# Altium schematic sheet dcdc.SchDoc
size A3; SheetNumber: 2; SheetTotal: 2
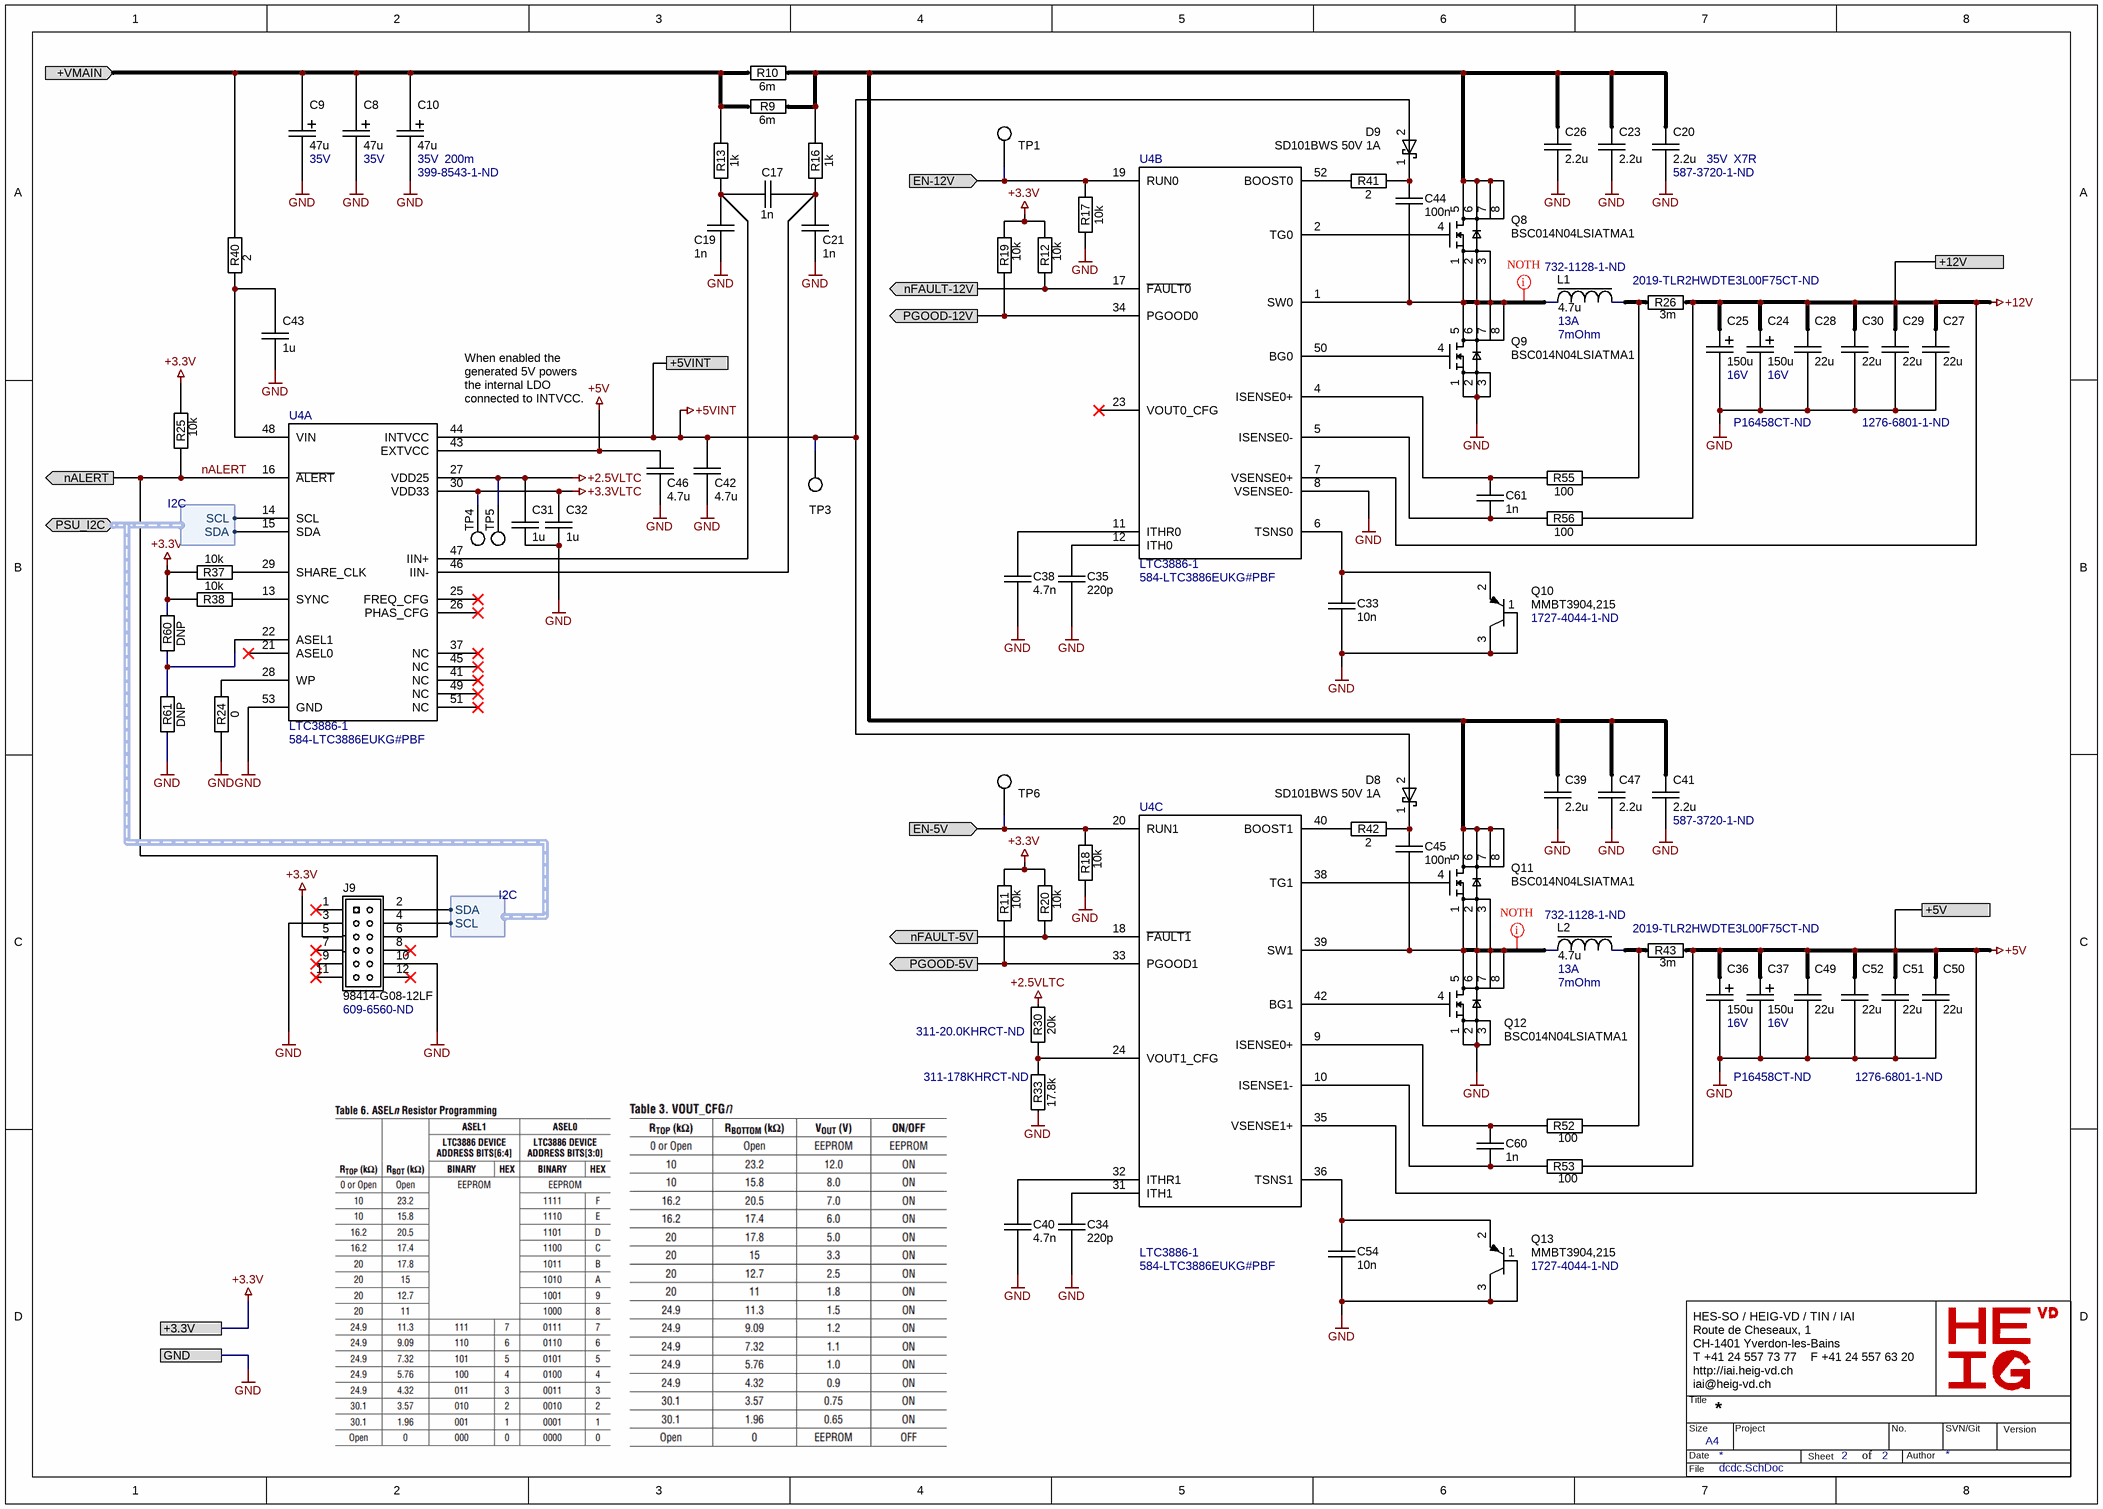
[diagram p0: dcdc.SchDoc]

## Parts
C8  47u  Voltage: 35V  [CAP-TANTAL-2917-7343]
C9  47u  Voltage: 35V  [CAP-TANTAL-2917-7343]
C10  47u  Supplier Part Number 1: 399-8543-1-ND  Voltage: 35V  ESR: 200m  [CAP-TANTAL-2917-7343]
C17  1n  [SM/C0603]
C19  1n  [SM/C0603]
C20  2.2u  Voltage: 35V  Dielectric: X7R  Supplier Part Number 1: 587-3720-1-ND  [SM/C1210]
C21  1n  [SM/C0603]
C23  2.2u  [SM/C1210]
C24  150u  Voltage: 16V  Supplier Part Number 1: P16458CT-ND  [CAP_16SVP150M]
C25  150u  Voltage: 16V  [CAP_16SVP150M]
C26  2.2u  [SM/C1210]
C27  22u  Supplier Part Number 1: 1276-6801-1-ND  [SM/C1210]
C28  22u  [SM/C1210]
C29  22u  [SM/C1210]
C30  22u  [SM/C1210]
C31  1u  [SM/C0603]
C32  1u  [SM/C0603]
C33  10n  [SM/C0603]
C34  220p  [SM/C0603]
C35  220p  [SM/C0603]
C36  150u  Voltage: 16V  [CAP_16SVP150M]
C37  150u  Voltage: 16V  Supplier Part Number 1: P16458CT-ND  [CAP_16SVP150M]
C38  4.7n  [SM/C0603]
C39  2.2u  [SM/C1210]
C40  4.7n  [SM/C0603]
C41  2.2u  Supplier Part Number 1: 587-3720-1-ND  [SM/C1210]
C42  4.7u  [SM/C0603]
C43  1u  [SM/C0603]
C44  100n  [SM/C0603]
C45  100n  [SM/C0603]
C46  4.7u  [SM/C0603]
C47  2.2u  [SM/C1210]
C49  22u  [SM/C1210]
C50  22u  Supplier Part Number 1: 1276-6801-1-ND  [SM/C1210]
C51  22u  [SM/C1210]
C52  22u  [SM/C1210]
C54  10n  [SM/C0603]
C60  1n  [SM/C0603]
C61  1n  [SM/C0603]
D8  SD101BWS 50V 1A  [SOD323]
D9  SD101BWS 50V 1A  [SOD323]
J9  98414-G08-12LF  Supplier Part Number 1: 609-6560-ND  [CONN14 2mm]
L1  4.7u  Supplier Part Number 1: 732-1128-1-ND  Imax: 13A  Rs: 7mOhm  [WE-7443551470]
L2  4.7u  Supplier Part Number 1: 732-1128-1-ND  Imax: 13A  Rs: 7mOhm  [WE-7443551470]
Q8  BSC014N04LSIATMA1  [PG-TDSON-8_INF]
Q9  BSC014N04LSIATMA1  [PG-TDSON-8_INF]
Q10  MMBT3904,215  Supplier Part Number 1: 1727-4044-1-ND  [SOT23-3]
Q11  BSC014N04LSIATMA1  [PG-TDSON-8_INF]
Q12  BSC014N04LSIATMA1  [PG-TDSON-8_INF]
Q13  MMBT3904,215  Supplier Part Number 1: 1727-4044-1-ND  [SOT23-3]
R9  6m  [SM/R1206]
R10  6m  [SM/R1206]
R11  10k  [SM/R0603]
R12  10k  [SM/R0603]
R13  1k  [SM/R0603]
R16  1k  [SM/R0603]
R17  10k  [SM/R0603]
R18  10k  [SM/R0603]
R19  10k  [SM/R0603]
R20  10k  [SM/R0603]
R24  0  [SM/R0603]
R25  10k  [SM/R0603]
R26  3m  [SM/R2010]
R30  20k  Supplier Part Number 1: 311-20.0KHRCT-ND  [SM/R0603]
R33  17.8k  Supplier Part Number 1: 311-178KHRCT-ND  [SM/R0603]
R37  10k  [SM/R0603]
R38  10k  [SM/R0603]
R40  2  [SM/R0603]
R41  2  [SM/R0603]
R42  2  [SM/R0603]
R43  3m  [SM/R2010]
R52  100  [SM/R0603]
R53  100  [SM/R0603]
R55  100  [SM/R0603]
R56  100  [SM/R0603]
R60  DNP  [SM/R0603]
R61  DNP  [SM/R0603]
TP1  TP  [TP/0.6]  (value not drawn)  (no BOM)
TP3  TP  [TP/0.6]  (value not drawn)  (no BOM)
TP4  TP  [TP/0.6]  (value not drawn)  (no BOM)
TP5  TP  [TP/0.6]  (value not drawn)  (no BOM)
TP6  TP  [TP/0.6]  (value not drawn)  (no BOM)
U4  LTC3886-1  Supplier Part Number 1: 584-LTC3886EUKG#PBF  [LT3886]  (parts A,B,C of 3)

## Ports
+3.3V, +5V, +5VINT, +12V, +VMAIN (in), EN-5V (in), EN-12V (in), GND, nALERT (out), nFAULT-5V (out), nFAULT-12V (out), PGOOD-5V (out), PGOOD-12V (out), PSU_I2C (bidir, harness I2C)

## Harnesses
I2C: SDA, SCL

## Nets
+2.5VLTC: C31.1 R30.2 TP5.1 U4.27(VDD25)
+3.3V: J9.5 R11.2 R12.2 R19.2 R20.2 R25.2 R37.2 R38.2 R60.1 ; port +3.3V
+3.3VLTC: C32.1 TP4.1 U4.30(VDD33)
+5V: C36.1(+) C37.1(+) C46.1 C49.1 C50.1 C51.1 C52.1 R43.1 R53.2 U4.35(VSENSE1+) U4.43(EXTVCC) ; port +5V
+5VINT: C42.1 D8.2(ANODE) D9.2(ANODE) TP3.1 U4.44(INTVCC) ; port +5VINT
+12V: C24.1(+) C25.1(+) C27.1 C28.1 C29.1 C30.1 R26.1 R56.2 U4.7(VSENSE0+) ; port +12V
GND: C8.2(-) C9.2(-) C10.2(-) C19.2 C20.1 C21.2 C23.1 C24.2(-) C25.2(-) C26.1 C27.2 C28.2 C29.2 C30.2 C31.2 C32.2 C33.2 C34.2 C35.2 C36.2(-) C37.2(-) C38.2 C39.1 C40.2 C41.1 C42.2 C43.2 C46.2 C47.1 C49.2 C50.2 C51.2 C52.2 C54.2 J9.3 J9.10 Q9.1(S) Q9.2(S) Q9.3(S) Q10.1(B) Q10.3(C) Q12.1(S) Q12.2(S) Q12.3(S) Q13.1(B) Q13.3(C) R17.1 R18.1 R24.2 R33.1 R61.2 U4.8(VSENSE0-) U4.53(GND) ; port GND
+VMAIN: C8.1(+) C9.1(+) C10.1(+) R9.1 R10.1 R13.2 R40.2 ; port +VMAIN
EN-5V: R18.2 TP6.1 U4.20(RUN1) ; port EN-5V
EN-12V: R17.2 TP1.1 U4.19(RUN0) ; port EN-12V
nALERT: J9.6 R25.1 U4.16(~{ALERT}) ; port nALERT
nFAULT-5V: R20.1 U4.18(~{FAULT1}) ; port nFAULT-5V
nFAULT-12V: R12.1 U4.17(~{FAULT0}) ; port nFAULT-12V
PGOOD-5V: R11.1 U4.33(PGOOD1) ; port PGOOD-5V
PGOOD-12V: R19.1 U4.34(PGOOD0) ; port PGOOD-12V
NetC17_1: C17.1 C19.1 R13.1 U4.47(IIN+)
NetC17_2: C17.2 C21.1 R16.1 U4.46(IIN-)
NetC20_2: C20.2 C23.2 C26.2 C39.2 C41.2 C47.2 Q8.5(D) Q8.6(D) Q8.7(D) Q8.8(D) Q11.5(D) Q11.6(D) Q11.7(D) Q11.8(D) R9.2 R10.2 R16.2
NetC33_1: C33.1 Q10.2(E) U4.6(TSNS0)
NetC34_1: C34.1 U4.31(ITH1)
NetC35_1: C35.1 U4.12(ITH0)
NetC38_1: C38.1 U4.11(ITHR0)
NetC40_1: C40.1 U4.32(ITHR1)
NetC43_1: C43.1 R40.1 U4.48(VIN)
NetC44_1: C44.1 D9.1(CATHODE) R41.2
NetC44_2: C44.2 L1.2 Q8.1(S) Q8.2(S) Q8.3(S) Q9.5(D) Q9.6(D) Q9.7(D) Q9.8(D) U4.1(SW0)
NetC45_1: C45.1 D8.1(CATHODE) R42.2
NetC45_2: C45.2 L2.2 Q11.1(S) Q11.2(S) Q11.3(S) Q12.5(D) Q12.6(D) Q12.7(D) Q12.8(D) U4.39(SW1)
NetC54_1: C54.1 Q13.2(E) U4.36(TSNS1)
NetC60_1: C60.1 R52.1 U4.9(ISENSE0+)
NetC60_2: C60.2 R53.1 U4.10(ISENSE1-)
NetC61_1: C61.1 R55.1 U4.4(ISENSE0+)
NetC61_2: C61.2 R56.1 U4.5(ISENSE0-)
NetJ9_2: J9.2 U4.15(SDA) ; port PSU_I2C.SDA
NetJ9_4: J9.4 U4.14(SCL) ; port PSU_I2C.SCL
NetL1_1: L1.1 R26.2 R55.2
NetL2_1: L2.1 R43.2 R52.2
NetQ8_4: Q8.4(Gate) U4.2(TG0)
NetQ9_4: Q9.4(Gate) U4.50(BG0)
NetQ11_4: Q11.4(Gate) U4.38(TG1)
NetQ12_4: Q12.4(Gate) U4.42(BG1)
NetR24_1: R24.1 U4.28(WP)
NetR30_1: R30.1 R33.2 U4.24(VOUT1_CFG)
NetR37_1: R37.1 U4.29(SHARE_CLK)
NetR38_1: R38.1 U4.13(SYNC)
NetR41_1: R41.1 U4.52(BOOST0)
NetR42_1: R42.1 U4.40(BOOST1)
NetR60_2: R60.2 R61.1 U4.22(ASEL1)

Not connected (* = marked no-connect by the designer): J9 1* 7* 8* 9* 11* 12*; U4 21(ASEL0)* 23(VOUT0_CFG)* 25(FREQ_CFG)* 26(PHAS_CFG)* 37(NC)* 41(NC)* 45(NC)* 49(NC)* 51(NC)*

## Layout directives
rule Polygon Connect Style [Style - Direct Connect]: NetC44_2, NetC45_2

## Notes on the sheet
- (near U4) When enabled the generated 5V powers the internal LDO connected to INTVCC.
- HES-SO / HEIG-VD / TIN / IAI
  Route de Cheseaux, 1
  CH-1401 Yverdon-les-Bains
  T +41 24 557 73 77    F +41 24 557 63 20
  http://iai.heig-vd.ch
  iai@heig-vd.ch
- Title
- Size
- Date
- A4
- Project
- Sheet
- of
- No.
- Author
- SVN/Git
- Version
- File

## Library data of the parts
C8 C9 = C+2312: 47µF Molded Tantalum Capacitors 25V 2917 (7343 Metric) 900mOhm; Rule: UNIONINDEX=0|RULEKIND=PolygonConnect|NETSCOPE=AnyNet|LAYERKIND=SameLayer|NAME=Schematic Polygon Connect Style|CONNECTSTYLE=Relief|RELIEFCONDUCTORWIDTH=39.3701mil|RELIEFENTRIES=4|POLYGONRELIEFANGLE=90 Angle|AIRGAPWIDTH=5.9055mil|UNIT=Metric; ESR: 200m; Supplier 1: Digi-Key; Supplier Part Number 1: 399-8543-1-ND; Value: 47u
C10 = C+2312: 47µF Molded Tantalum Capacitors 25V 2917 (7343 Metric) 900mOhm; Rule: UNIONINDEX=0|RULEKIND=PolygonConnect|NETSCOPE=AnyNet|LAYERKIND=SameLayer|NAME=Schematic Polygon Connect Style|CONNECTSTYLE=Relief|RELIEFCONDUCTORWIDTH=39.3701mil|RELIEFENTRIES=4|POLYGONRELIEFANGLE=90 Angle|AIRGAPWIDTH=5.9055mil|UNIT=Metric; Supplier 1: Digi-Key; Value: 47u
C17 C19 C21 C31-C35 C38 C40 C42-C46 C54 C60 C61 = C: Chip Capacitor; Voltage: 16V; Dielectric: X7R
  C17 C60: Supplier 2 Part Number: 1292-1393-1-ND; Supplier 2: Digi-Key; Value: 1n
  C19 C21 C61: Value: 1n
  C31 C32: Value: 1u
  C33: Supplier 2 Part Number: 1292-1393-1-ND; Supplier 2: Digi-Key; Value: 10n
  C34 C35: Supplier 2 Part Number: 1292-1393-1-ND; Supplier 2: Digi-Key; Value: 220p
  C38 C40: Supplier 2 Part Number: 1292-1393-1-ND; Supplier 2: Digi-Key; Value: 4.7n
  C42 C46: Value: 4.7u
  C43: Supplier 2 Part Number: 1292-1393-1-ND; Supplier 2: Digi-Key; Value: 1u
  C44 C45: Supplier 2 Part Number: 1292-1393-1-ND; Supplier 2: Digi-Key; Value: 100n
  C54: Value: 10n
C20 C23 C26 = C: GMK325B7225KNHT CAP CER 2.2UF 35V X7R 1210; Rule: UNIONINDEX=0|RULEKIND=PolygonConnect|NETSCOPE=AnyNet|LAYERKIND=SameLayer|NAME=Schematic Polygon Connect Style|CONNECTSTYLE=Relief|RELIEFCONDUCTORWIDTH=39.3701mil|RELIEFENTRIES=4|POLYGONRELIEFANGLE=90 Angle|AIRGAPWIDTH=5.9055mil|UNIT=Metric; Supplier 1: Digi-Key; Value: GMK325B7225KNHT
  C23 C26: Voltage: 35V; Dielectric: X7R; Supplier Part Number 1: 587-3720-1-ND
C24 C25 C36 C37 = C+2312: CAP ALUM POLY 150UF 20% 16V SMD; Rule: UNIONINDEX=0|RULEKIND=PolygonConnect|NETSCOPE=AnyNet|LAYERKIND=SameLayer|NAME=Schematic Polygon Connect Style|CONNECTSTYLE=Relief|RELIEFCONDUCTORWIDTH=39.3701mil|RELIEFENTRIES=4|POLYGONRELIEFANGLE=90 Angle|AIRGAPWIDTH=5.9055mil|UNIT=Metric; Value: 16SVP150M; Supplier 1: Digi-Key
  C25 C36: Supplier Part Number 1: P16458CT-ND
C27-C29 C49-C52 = C: CL32B226KOJVPJE CAP CER 22UF 16V X7R 1210; Rule: UNIONINDEX=0|RULEKIND=PolygonConnect|NETSCOPE=AnyNet|LAYERKIND=SameLayer|NAME=Schematic Polygon Connect Style|CONNECTSTYLE=Relief|RELIEFCONDUCTORWIDTH=39.3701mil|RELIEFENTRIES=4|POLYGONRELIEFANGLE=90 Angle|AIRGAPWIDTH=5.9055mil|UNIT=Metric; Supplier 1: Digi-Key; Value: 22u
  C28 C29 C49 C51 C52: Supplier Part Number 1: 1276-6801-1-ND
C30 = C: CL32B226KOJVPJE CAP CER 22UF 16V X7R 1210; Rule: UNIONINDEX=0|RULEKIND=PolygonConnect|NETSCOPE=AnyNet|LAYERKIND=SameLayer|NAME=Schematic Polygon Connect Style|THPAD.CONNECTSTYLE=Relief|THPAD.RELIEFCONDUCTORWIDTH=39.3701mil|THPAD.RELIEFENTRIES=4|THPAD.POLYGONRELIEFANGLE=90 Angle|THPAD.AIRGAPWIDTH=5.9055mil|SMDPAD.CONNECTSTYLE=Relief|SMDPAD.RELIEFCONDUCTORWIDTH=39.3701mil|SMDPAD.RELIEFENTRIES=4|SMDPAD.POLYGONRELIEFANGLE=90 Angle|SMDPAD.AIRGAPWIDTH=5.9055mil|VIA.CONNECTSTYLE=Direct|VIA.RELIEFCONDUCTORWIDTH=10mil|VIA.RELIEFENTRIES=4|VIA.POLYGONRELIEFANGLE=45 Angle|VIA.AIRGAPWIDTH=10mil|UNIT=Metric; Supplier 1: Digi-Key; Supplier Part Number 1: 1276-6801-1-ND; Value: 22u
C39 C41 C47 = C: GMK325B7225KNHT CAP CER 2.2UF 35V X7R 1210; Voltage: 16V; Rule: UNIONINDEX=0|RULEKIND=PolygonConnect|NETSCOPE=AnyNet|LAYERKIND=SameLayer|NAME=Schematic Polygon Connect Style|CONNECTSTYLE=Relief|RELIEFCONDUCTORWIDTH=39.3701mil|RELIEFENTRIES=4|POLYGONRELIEFANGLE=90 Angle|AIRGAPWIDTH=5.9055mil|UNIT=Metric; Dielectric: X7R; Supplier 2 Part Number: 1292-1393-1-ND; Supplier 2: Digi-Key; Supplier 1: Digi-Key; Value: 2.2u
  C39 C47: Supplier Part Number 1: 587-3720-1-ND
D8 D9 = D SCHOTTKY CUS520: Diode Schottky 30V 200mA Surface Mount USC; Value: SD101BWS-TP; Supplier 1: Digi-Key; Supplier Part Number 1: SD101BWSTPMSCT-ND
J9 = CONN 12: CONN HEADER VERT 12POS 2MM; Supplier 1: Digi-Key; Value: 98414-G08-12LF
L1 L2 = L: FIXED IND 4.7UH 13A 7 MOHM SMD / 7443551470; Value: 732-1128-1-ND; Rule: UNIONINDEX=0|RULEKIND=PolygonConnect|NETSCOPE=AnyNet|LAYERKIND=SameLayer|NAME=Schematic Polygon Connect Style|THPAD.CONNECTSTYLE=Relief|THPAD.RELIEFCONDUCTORWIDTH=39.3701mil|THPAD.RELIEFENTRIES=4|THPAD.POLYGONRELIEFANGLE=90 Angle|THPAD.AIRGAPWIDTH=5.9055mil|SMDPAD.CONNECTSTYLE=Relief|SMDPAD.RELIEFCONDUCTORWIDTH=39.3701mil|SMDPAD.RELIEFENTRIES=4|SMDPAD.POLYGONRELIEFANGLE=90 Angle|SMDPAD.AIRGAPWIDTH=5.9055mil|VIA.CONNECTSTYLE=Relief|VIA.RELIEFCONDUCTORWIDTH=10mil|VIA.RELIEFENTRIES=4|VIA.POLYGONRELIEFANGLE=45 Angle|VIA.AIRGAPWIDTH=10mil|UNIT=Metric; Isat: *; Supplier 1: Digi-Key
Q8 Q9 Q11 Q12 = BSC0502NSIATMA1: MOSFET N-CH 40V 31A/100A TDSON; Rule: UNIONINDEX=0|RULEKIND=PolygonConnect|NETSCOPE=AnyNet|LAYERKIND=SameLayer|NAME=Schematic Polygon Connect Style|CONNECTSTYLE=Relief|RELIEFCONDUCTORWIDTH=11.811mil|RELIEFENTRIES=4|POLYGONRELIEFANGLE=90 Angle|AIRGAPWIDTH=5.9055mil|UNIT=Metric; Value: BSC014N04LSIATMA1; Supplier 1: Digi-Key; Supplier Part Number 1: BSC014N04LSIATMA1CT-ND
Q10 Q13 = Q/FMMT558: TRANS PNP 400V 150MA HV SOT23-3; Value: MMBT3904,215; Supplier 1: Digi-Key
R9 R10 = R: Chip Resistor SMD; Value: RHM.006ALCT; Rule: UNIONINDEX=0|RULEKIND=PolygonConnect|NETSCOPE=AnyNet|LAYERKIND=SameLayer|NAME=Schematic Polygon Connect Style|CONNECTSTYLE=Relief|RELIEFCONDUCTORWIDTH=39.3701mil|RELIEFENTRIES=4|POLYGONRELIEFANGLE=90 Angle|AIRGAPWIDTH=5.9055mil|UNIT=Metric; Supplier 1: Digi-Key; Supplier Part Number 1: RHM.006ALCT-ND
R11-R13 R16-R20 R24 R25 R33 R37 R38 R40-R42 R52 R53 R55 R56 R60 R61 = R: Chip Resistor SMD
  R11 R12 R17-R20 R25 R37 R38: Value: 10k
  R13 R16: Value: 1k
  R24: Value: 0
  R33: Value: 17.8k; Supplier 1: Digi-Key
  R40-R42: Value: 2
  R52 R53 R55 R56: Value: 100
  R60 R61: Value: DNP
R26 = R: 2019-TLR2HWDTE3L00F75CT-ND; Rule: UNIONINDEX=0|RULEKIND=PolygonConnect|NETSCOPE=AnyNet|LAYERKIND=SameLayer|NAME=Schematic Polygon Connect Style|CONNECTSTYLE=Relief|RELIEFCONDUCTORWIDTH=39.3701mil|RELIEFENTRIES=4|POLYGONRELIEFANGLE=90 Angle|AIRGAPWIDTH=5.9055mil|UNIT=Metric; Supplier 1: Digi-Key; Supplier Part Number 1: 2019-TLR2HWDTE3L00F75CT-ND; Value: TLR2HWDTE3L00F75
R30 = R: Chip Resistor SMD; Value: RC0603FR-0720KL; Supplier 1: Digi-Key
R43 = R: 2019-TLR2HWDTE3L00F75CT-ND; Rule: UNIONINDEX=0|RULEKIND=PolygonConnect|NETSCOPE=AnyNet|LAYERKIND=SameLayer|NAME=Schematic Polygon Connect Style|CONNECTSTYLE=Relief|RELIEFCONDUCTORWIDTH=39.3701mil|RELIEFENTRIES=4|POLYGONRELIEFANGLE=45 Angle|AIRGAPWIDTH=5.9055mil|UNIT=Metric; Supplier 1: Digi-Key; Supplier Part Number 1: 2019-TLR2HWDTE3L00F75CT-ND; Value: TLR2HWDTE3L00F75
TP1 TP3-TP6 = TP: Test Point
U4 = LTC3886: Supplier 1: Mouser; Value: LTC3886-1